# EAGLE design pro2 (EAGLE 9.6.2)
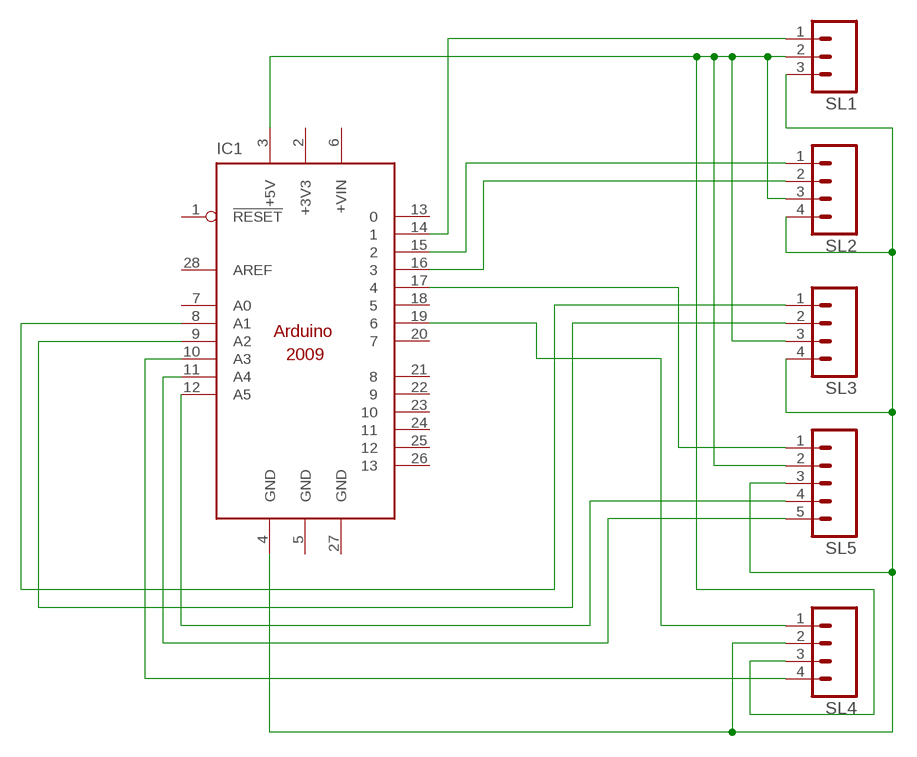
[diagram p0: schematic, sheet 1]

## Parts
IC1  ARDUINO2009_10  [ARDUINO2009]
SL1  M03  [03P]
SL2  M04  [04P]
SL3  M04  [04P]
SL4  M04  [04P]
SL5  M05  [05P]

## Nets
N$1: IC1.12(A5) SL5.4
N$2: IC1.14 SL1.1
N$3: IC1.15 SL2.1
N$4: IC1.16 SL2.2
N$5: IC1.3(+5V) SL1.2 SL2.3 SL3.3 SL4.3 SL5.2
N$6: IC1.4(GND) SL1.3 SL2.4 SL3.4 SL4.2 SL5.3
N$7: IC1.8(A1) SL3.1
N$8: IC1.9(A2) SL3.2
N$9: IC1.11(A4) SL5.5
N$10: IC1.17 SL5.1
N$11: IC1.19 SL4.1
N$12: IC1.10(A3) SL4.4
Unconnected: IC1.1(!RESET) IC1.6(+VIN) IC1.7(A0) IC1.13 IC1.18 IC1.20 IC1.21 IC1.22 IC1.23 IC1.24 IC1.25 IC1.26 IC1.28(AREF)

## Power pins joined to a net without a drawn wire
+3V3: IC1.2(+3V3)
GND: IC1.5(GND) IC1.27(GND)

## Library data of the parts
IC1 = arduino:ARDUINO2009_1: The Arduino Duemilanove ("2009") is a microcontroller board based on the ATmega168 or ATmega328. - 14 digital input/output pins (of which 6 can be used as PWM outputs) - 6 analog inputs, a 16 MHz crystal oscillator - USB connection - power jack - ISP header - reset button It contains everything needed to support the microcontroller; simply connect it to a computer with a USB cable or power it with a AC-to-DC adapter or battery to get started http://arduino.cc/en/Main/ArduinoBoardDuemilanove
SL1 = con-amp-quick:M03: AMP QUICK CONNECTOR; OC_FARNELL: unknown; OC_NEWARK: unknown
SL2-SL4 = con-amp-quick:M04: AMP QUICK CONNECTOR; OC_FARNELL: unknown; OC_NEWARK: unknown
SL5 = con-amp-quick:M05: AMP QUICK CONNECTOR; OC_FARNELL: unknown; OC_NEWARK: unknown

## Board
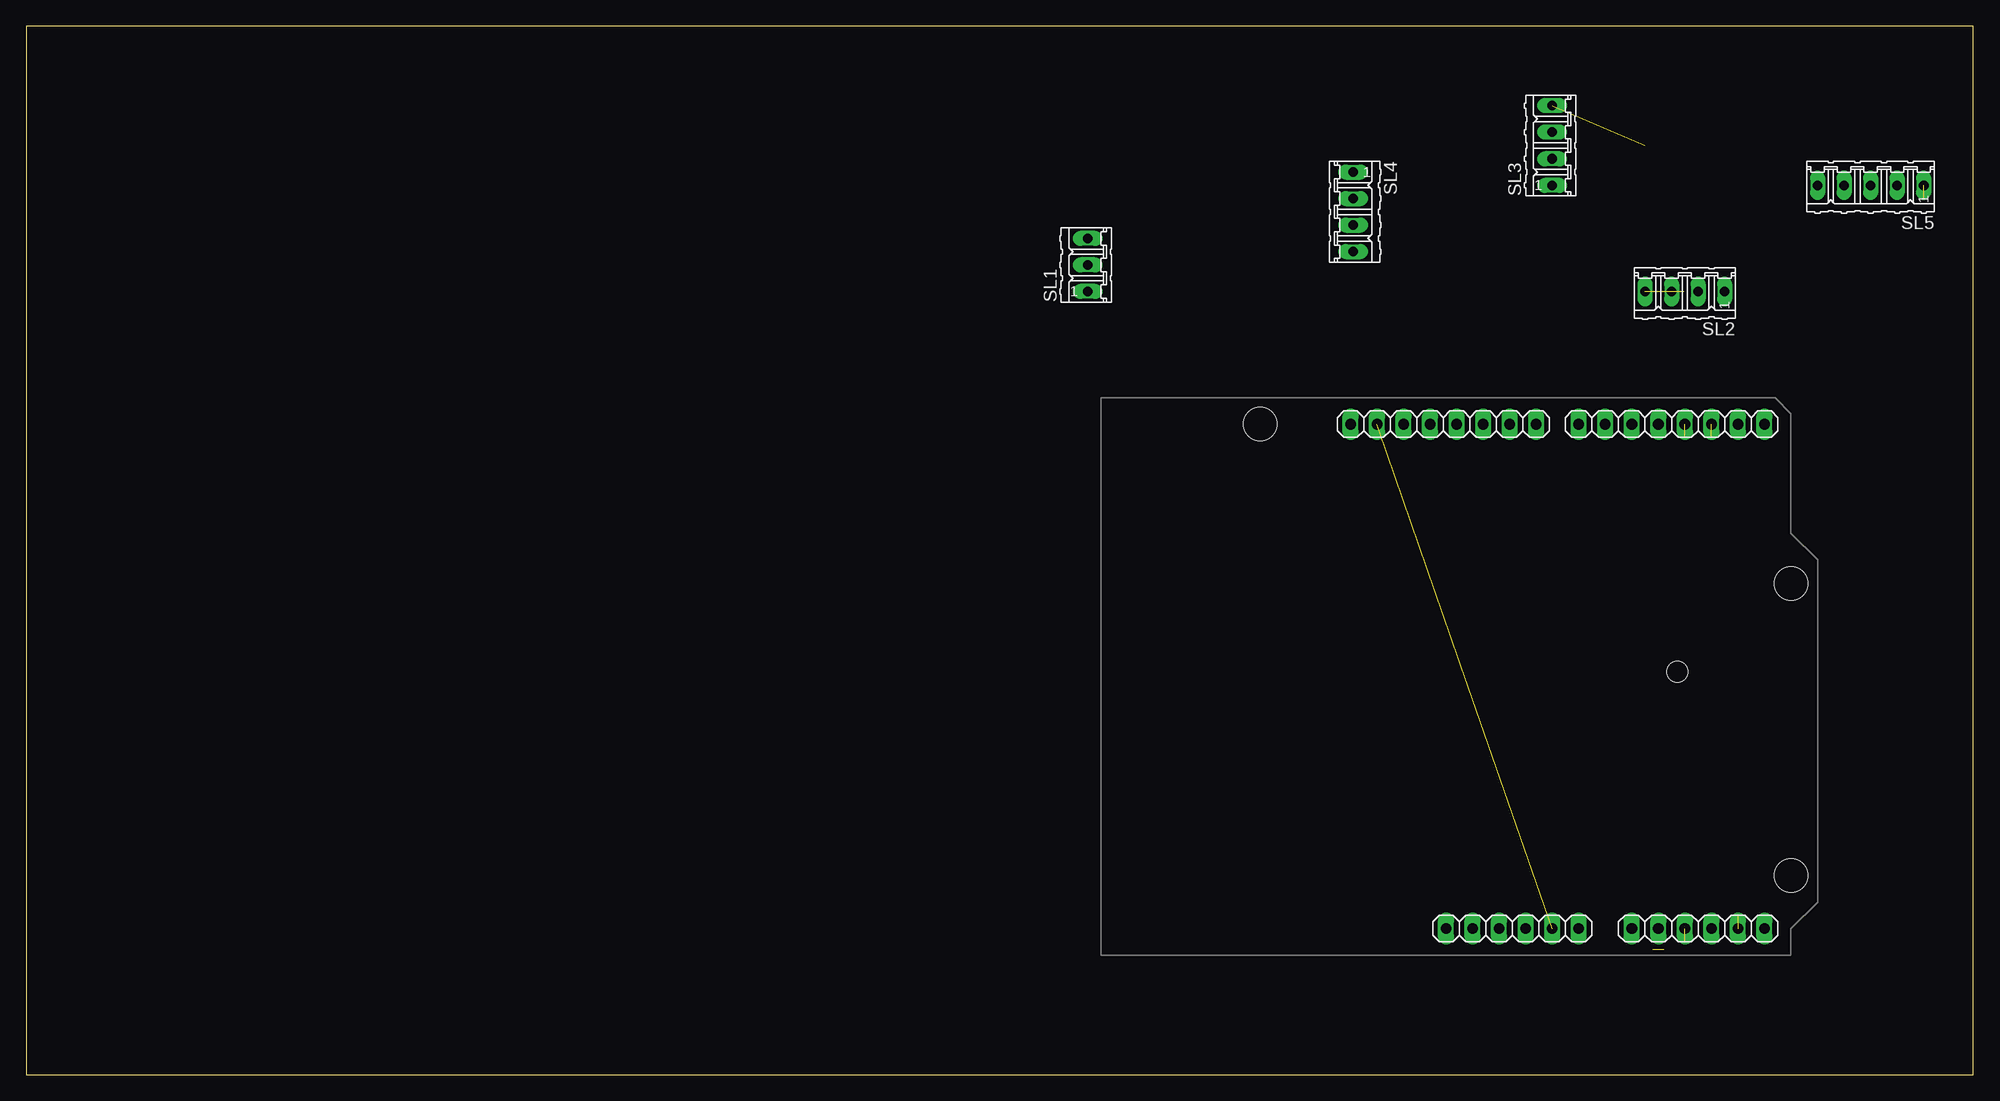
[diagram p1: board, top side]
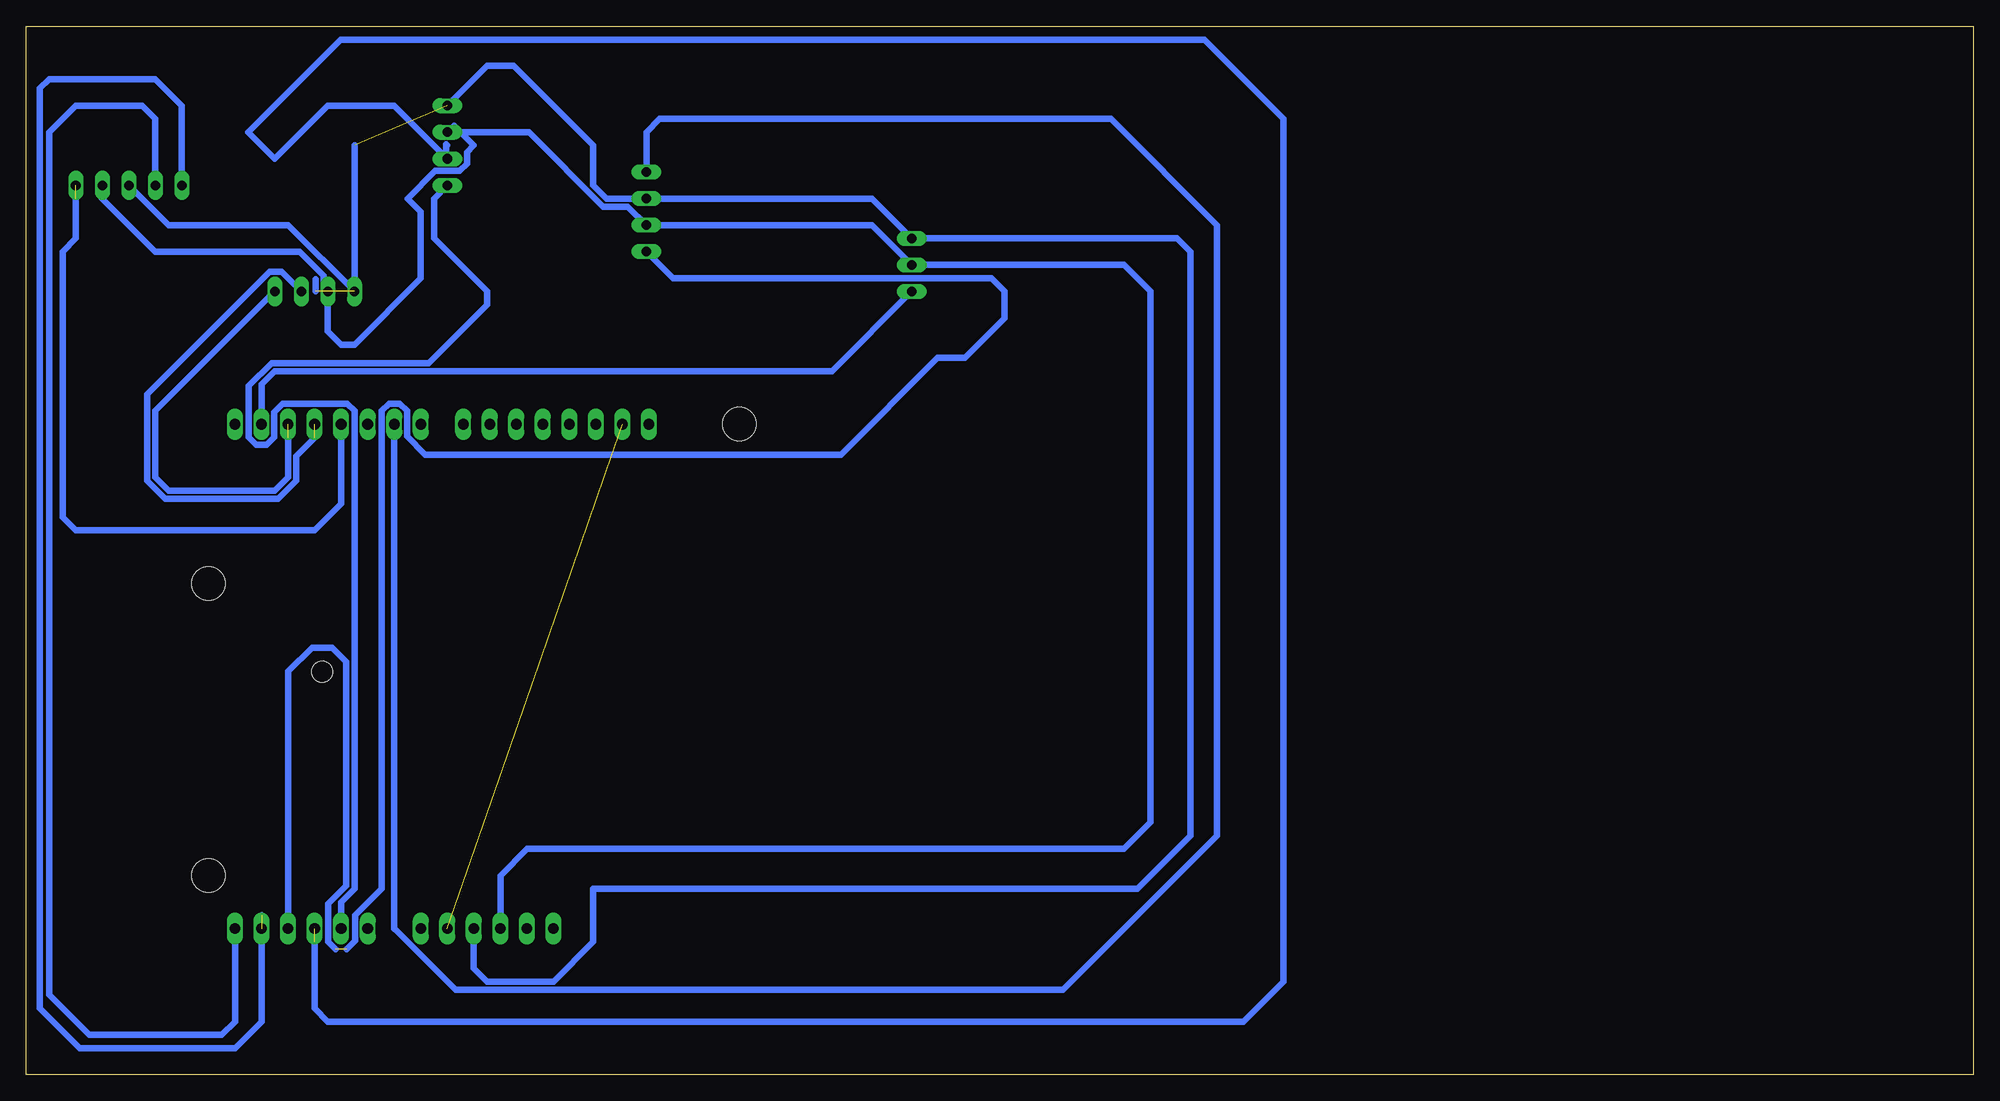
[diagram p2: board, bottom side, seen from below]

Size 186.36 x 100.32 mm. Coordinates in mm from the lower left corner, seen from the top.
Outline: 0,0 186.36,0 186.36,100.32 0,100.32 0,0
Copper layers (1*16): Top 0.035mm / dielectric 1.5mm / Bottom 0.035mm
Design rules "default": minimum track width 6mil, minimum drill 0.35mm, track to track 6mil, track to pad 6mil, pad to pad 6mil, via to via 6mil, smd to smd 6mil, copper to edge 40mil, drill to drill 6mil, minimum pad ring 10mil, minimum via ring 8mil, stop-mask expansion 4mil, vias tented up to drill 0mil, thermal gap 10mil

### Footprints (pad centres in the part's own frame; a part is rotated, then mirrored left to right if it is on the bottom)
ARDUINO2009 = drill 1.016 long: 1 33.02,2.54; 2 35.56,2.54; 3 38.1,2.54; 4 40.64,2.54; 5 43.18,2.54; 6 45.72,2.54; 7 50.8,2.54; 8 53.34,2.54; 9 55.88,2.54; 10 58.42,2.54; 11 60.96,2.54; 12 63.5,2.54; 13 63.5,50.8; 14 60.96,50.8; 15 58.42,50.8; 16 55.88,50.8; 17 53.34,50.8; 18 50.8,50.8; 19 48.26,50.8; 20 45.72,50.8; 21 41.656,50.8; 22 39.116,50.8; 23 36.576,50.8; 24 34.036,50.8; 25 31.496,50.8; 26 28.956,50.8; 27 26.416,50.8; 28 23.876,50.8 | hole 3.2: 15.24,50.8; 66.04,35.56; 66.04,7.62 | hole 2: 55.17,27.114
03P = drill 0.914 long: 1 -2.54,0; 2 0,0; 3 2.54,0
04P = drill 0.914 long: 1 -3.81,0; 2 -1.27,0; 3 1.27,0; 4 3.81,0
05P = drill 0.914 long: 1 -5.08,0; 2 -2.54,0; 3 0,0; 4 2.54,0; 5 5.08,0

### Placement (x,y rotation side)
IC1  102.87,11.43 0 top
SL1  101.6,77.47 90 top
SL2  158.75,74.93 180 top
SL3  146.05,88.9 90 top
SL4  127,82.55 270 top
SL5  176.53,85.09 180 top

### Tracks (layer width: path | path; a pad name or v marks a point on that pad's centre or on a via)
GND  (1 unrouted)
N$1
  Bottom 0.61: SL5.4 173.99,91.44 175.26,92.71 181.61,92.71 184.15,90.17 184.15,7.62 180.34,3.81 167.64,3.81 166.37,5.08 IC1.12
N$2
  Bottom 0.61: SL1.1 109.22,67.31 162.56,67.31 163.83,66.04 IC1.14
N$3  (1 unrouted)
  Bottom 0.152: 162.56,73.66 SL2.1
  Bottom 0.61: 161.29,60.96 161.29,57.15 162.56,55.88 172.72,55.88 173.99,57.15 173.99,63.5 SL2.1
N$4  (1 unrouted)
  Bottom 0.61: 158.75,60.96 160.53,59.18 160.53,56.83 162.24,55.12 173.04,55.12 174.75,56.83 174.75,65.1 163.04,76.81 162.56,76.81 162.08,76.81 161.9,76.81 SL2.2 160.2,74.93
N$5
  Bottom 0.61: IC1.3 140.97,19.05 138.43,21.59 81.28,21.59 78.74,24.13 78.74,74.93 81.28,77.47 SL1.2 105.41,81.28 SL4.3 128.78,83.06 131.13,83.06 138.24,90.17 SL3.3 145.41,90.8 143.51,88.9 144.17,88.24 144.17,87.15 144.85,86.46 147.22,86.46 149.86,83.82 148.59,82.55 148.59,76.2 154.94,69.85 156.21,69.85 157.48,71.12 SL2.3 | 157.3,74.93 SL2.3 | SL5.2 179.07,83.82 173.99,78.74 160.19,78.74 157.89,76.44 157.89,75.34 SL2.3
N$6  (2 unrouted)
  Bottom 0.61: IC1.4 143.51,10.16 142.24,8.89 135.89,8.89 132.08,12.7 132.08,17.78 80.01,17.78 74.93,22.86 74.93,78.74 76.2,80.01 SL1.3 105.41,83.82 SL4.2 130.81,83.82 132.08,85.09 132.08,88.9 139.7,96.52 142.24,96.52 SL3.4 | 158.65,74.93 158.65,76.12 | 154.94,77.47 SL2.4 | SL5.3 172.72,81.28 161.29,81.28 SL2.4 | SL2.4 154.94,88.9
N$7
  Bottom 0.61: IC1.8 156.21,16.51 154.94,17.78 154.94,63.5 155.65,64.21 161.8,64.21 162.61,63.39 162.61,60.96 163.32,60.25 164.33,60.25 165.05,60.96 165.05,65.9 162.88,68.07 147.83,68.07 142.24,73.66 142.24,74.93 147.32,80.01 147.32,83.82 SL3.1
N$8  (1 unrouted)
  Bottom 0.61: 158.75,12.7 158.75,6.35 157.48,5.08 69.85,5.08 66.04,8.89 66.04,91.44 73.6,99 156.27,99 165.1,90.17 162.56,87.63 157.48,92.71 151.13,92.71 SL3.2 146.15,87.73 146.15,89 146.05,88.9
N$9  (1 unrouted)
  Bottom 0.61: SL5.5 171.45,92.71 173.99,95.25 184.15,95.25 185.04,94.36 185.04,6.35 181.23,2.54 166.37,2.54 163.83,5.08 163.83,15.24
N$10  (1 unrouted)
  Bottom 0.61: IC1.17 156.21,54.61 158.75,52.07 181.61,52.07 182.88,53.34 182.88,78.74 181.61,80.01 181.61,83.82
N$11
  Bottom 0.61: SL4.1 127,90.17 125.73,91.44 82.55,91.44 72.39,81.28 72.39,22.86 87.12,8.13 145.23,8.13 151.08,13.97 151.13,13.97 IC1.19
N$12  (1 unrouted)
  Bottom 0.61: 156.72,11.99 157.43,12.7 157.43,16.37 155.72,18.08 155.72,39.5 157.08,40.86 159,40.86 161.29,38.58 IC1.10 | SL4.4 124.46,76.2 93.98,76.2 92.71,74.93 92.71,72.39 96.52,68.58 99.11,68.58 108.38,59.31 148.16,59.31 149.91,61.06 149.91,63.5 150.62,64.21 151.63,64.21 152.35,63.5 152.35,17.78 154.89,15.24 154.89,12.8 155.7,11.99